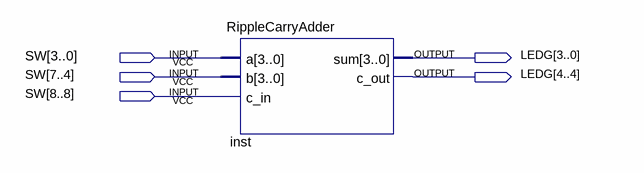
[diagram p0: schematic sheet]
// Quartus schematic block_ripple_carry_adder.bdf as structural Verilog: 1 symbols, 5 pins
module block_ripple_carry_adder (
  input  [8:0] SW,
  output [4:0] LEDG
);

  RippleCarryAdder inst (.a(SW[3:0]), .b(SW[7:4]), .c_in(SW[8]), .sum(LEDG[3:0]), .c_out(LEDG[4]));
endmodule
